# EAGLE schematic power (EAGLE 6.2)
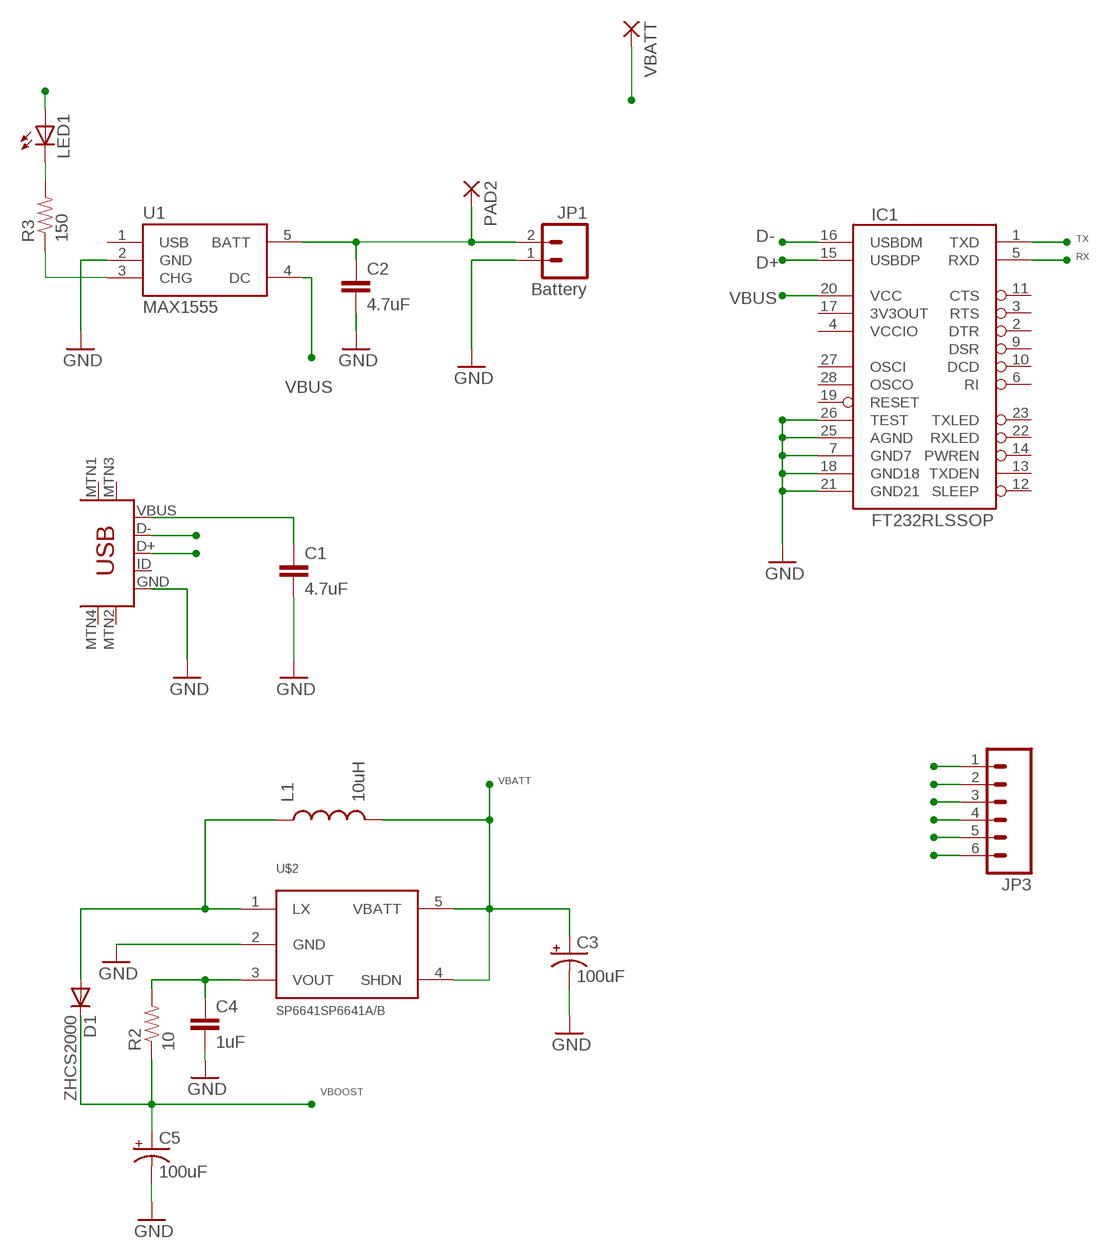
[diagram p0: schematic, sheet 1]

## Parts
C1  4.7uF  CAP1206  [1206]
C2  4.7uF  CAP1206  [1206]
C3  100uF  CPOL-USD  [PANASONIC_D]
C4  1uF  CAP0805  [0805]
C5  100uF  CPOL-USD  [PANASONIC_D]
D1  ZHCS2000  DIODESMB  [SMB-DIODE]
IC1  FT232RLSSOP  [SSOP28DB]
JP1  Battery  M02-JST-2MM-SMT  [JST-2-SMD]
JP3  M06SMD  [1X06-SMD]
L1  10uH  INDUCTORCR54  [CR54]
LED1  LED0603  [LED-0603]
PAD2  WIREPAD2,54/1,0  [2,54/1,0]
R2  10  RESISTOR0603-RES  [0603-RES]
R3  150  RESISTOR0603-RES  [0603-RES]
U1  MAX1555  [SOT23-5]
U$1  USB-MINIB-5PIN  [USB-MINIB]
U$2  SP6641SP6641A/B  [SOT23-5]
VBATT  WIREPAD2,54/1,0  [2,54/1,0]

## Nets
D+: IC1.15(USBDP) U$1.D+
D-: IC1.16(USBDM) U$1.D-
GND: C1.2 C2.2 C3.- C4.2 C5.- IC1.7(GND7) IC1.18(GND18) IC1.21(GND21) IC1.25(AGND) IC1.26(TEST) JP1.1 JP3.6 U1.2(GND) U$1.GND U$2.2(GND)
LX: D1.A L1.P$1 U$2.1(LX)
N$2: LED1.C R3.2
N$4: R3.1 U1.3(CHG)
N$55: C2.1 JP1.2 PAD2.1(P) U1.5(BATT)
RX: IC1.5(RXD) JP3.1
TX: IC1.1(TXD) JP3.2
VBATT: C3.+ JP3.5 L1.P$2 U$2.4(SHDN) U$2.5(VBATT) VBATT.1(P)
VBOOST: C5.+ D1.C JP3.4 R2.1
VBUS: C1.1 IC1.20(VCC) JP3.3 LED1.A U1.4(DC) U$1.VBUS
VOUT: C4.1 R2.2 U$2.3(VOUT)
Unconnected: IC1.2(DTR) IC1.3(RTS) IC1.6(RI) IC1.9(DSR) IC1.10(DCD) IC1.11(CTS) IC1.12(SLEEP) IC1.13(TXDEN) IC1.14(PWREN) IC1.17(3V3OUT) IC1.19(RESET) IC1.22(RXLED) IC1.23(TXLED) IC1.27(OSCI) IC1.28(OSCO) U1.1(USB) U$1.ID U$1.MTN1(MTN2) U$1.MTN2(MTN3) U$1.MTN3(MTN1) U$1.MTN4

## Power pins joined to a net without a drawn wire
VCCIO: IC1.4(VCCIO)

## Library data of the parts
C1 C2 C4 = SparkFun:CAP: Capacitor Standard 0603 ceramic capacitor, and 0.1" leaded capacitor.
C3 C5 = rcl:CPOL-US: POLARIZED CAPACITOR, American symbol
D1 = SparkFun:DIODE: Diode These are standard reverse protection diodes and small signal diodes. SMA package can handle up to about 1A. SOD-323 can handle about 200mA. What the SOD-323 package when ordering, there are some mfgs out there that are 5-pin packages.
IC1 = SparkFun:FT232RL: USB UART FT232RL 4th Generation USB UART (USB <-> Serial) Controller. Spark Fun Electronics SKU : COM-00650
JP1 = SparkFun:M02: Header 2 Standard 2-pin 0.1" header. Use with straight break away headers (SKU : PRT-00116), right angle break away headers (PRT-00553), swiss pins (PRT-00743), machine pins (PRT-00117), and female headers (PRT-00115). Molex polarized connector foot print use with SKU : PRT-08233 with associated crimp pins and housings.
JP3 = SparkFun-Connectors:M06: Header 6 Standard 6-pin 0.1" header. Use with straight break away headers (SKU : PRT-00116), right angle break away headers (PRT-00553), swiss pins (PRT-00743), machine pins (PRT-00117), and female headers (PRT-00115). Molex polarized connector foot print use with SKU : PRT-08094 with associated crimp pins and housings. NOTES ON THE VARIANTS LOCK and LOCK_LONGPADS... This footprint was designed to help hold the alignment of a through-hole component (i.e. 6-pin header) while soldering it into place. You may notice that each hole has been shifted either up or down by 0.005 of an inch from it's more standard position (which is a perfectly straight line). This slight alteration caused the pins (the squares in the middle) to touch the edges of the holes. Because they are alternating, it causes a "brace" to hold the component in place. 0.005 has proven to be the perfect amount of "off-center" position when using our standard breakaway headers. Although looks a little odd when you look at the bare footprint, once you have a header in there, the alteration is very hard to notice. Also, if you push a header all the way into place, it is covered up entirely on the bottom side. This idea of altering the position of holes to aid alignment will be further integrated into the Sparkfun Library for other footprints. It can help hold any component with 3 or more connection pins.
L1 = SparkFun:INDUCTOR: Inductors Basic Inductor/Choke - 0603 and 1206. Footprints are not proven and vary greatly between part numbers.
LED1 = SparkFun:LED: LEDs Standard schematic elements and footprints for 5mm, 3mm, 1206, and 0603 sized LEDs. 5mm - Spark Fun Electronics SKU : COM-00529 (and others)
PAD2 VBATT = wirepad:WIREPAD: Wire PAD connect wire on PCB
R2 R3 = SparkFun:RESISTOR: Resistor Basic schematic elements and footprints for 0603, 1206, and PTH resistors.
U1 = SparkFun:MAX1555: MAX1555 Lithium Charger IC SOT-23 Lithium Polymer charging IC. Schematic element and footprint proven. Spark Fun Electronics SKU : COM-00674
U$1 = SparkFun:USB-MINIB: Mini-USB "B" connector with 5th pin broken out. Created new symbol breaking out 5th "ID" pin in mini/micro USB connector spec. See: http://en.wikipedia.org/wiki/Mini_usb#Cables. Uses same footprint as 4-pin symbol. Also added pins to connect to mounting / shield pads if required (probably not generally needed as signals aren't shielded once they leave the connector).
U$2 = Sipex Custom:SP6641